# Altium schematic sheet mcu_stm32f427.SchDoc
size C; SheetNumber: 2
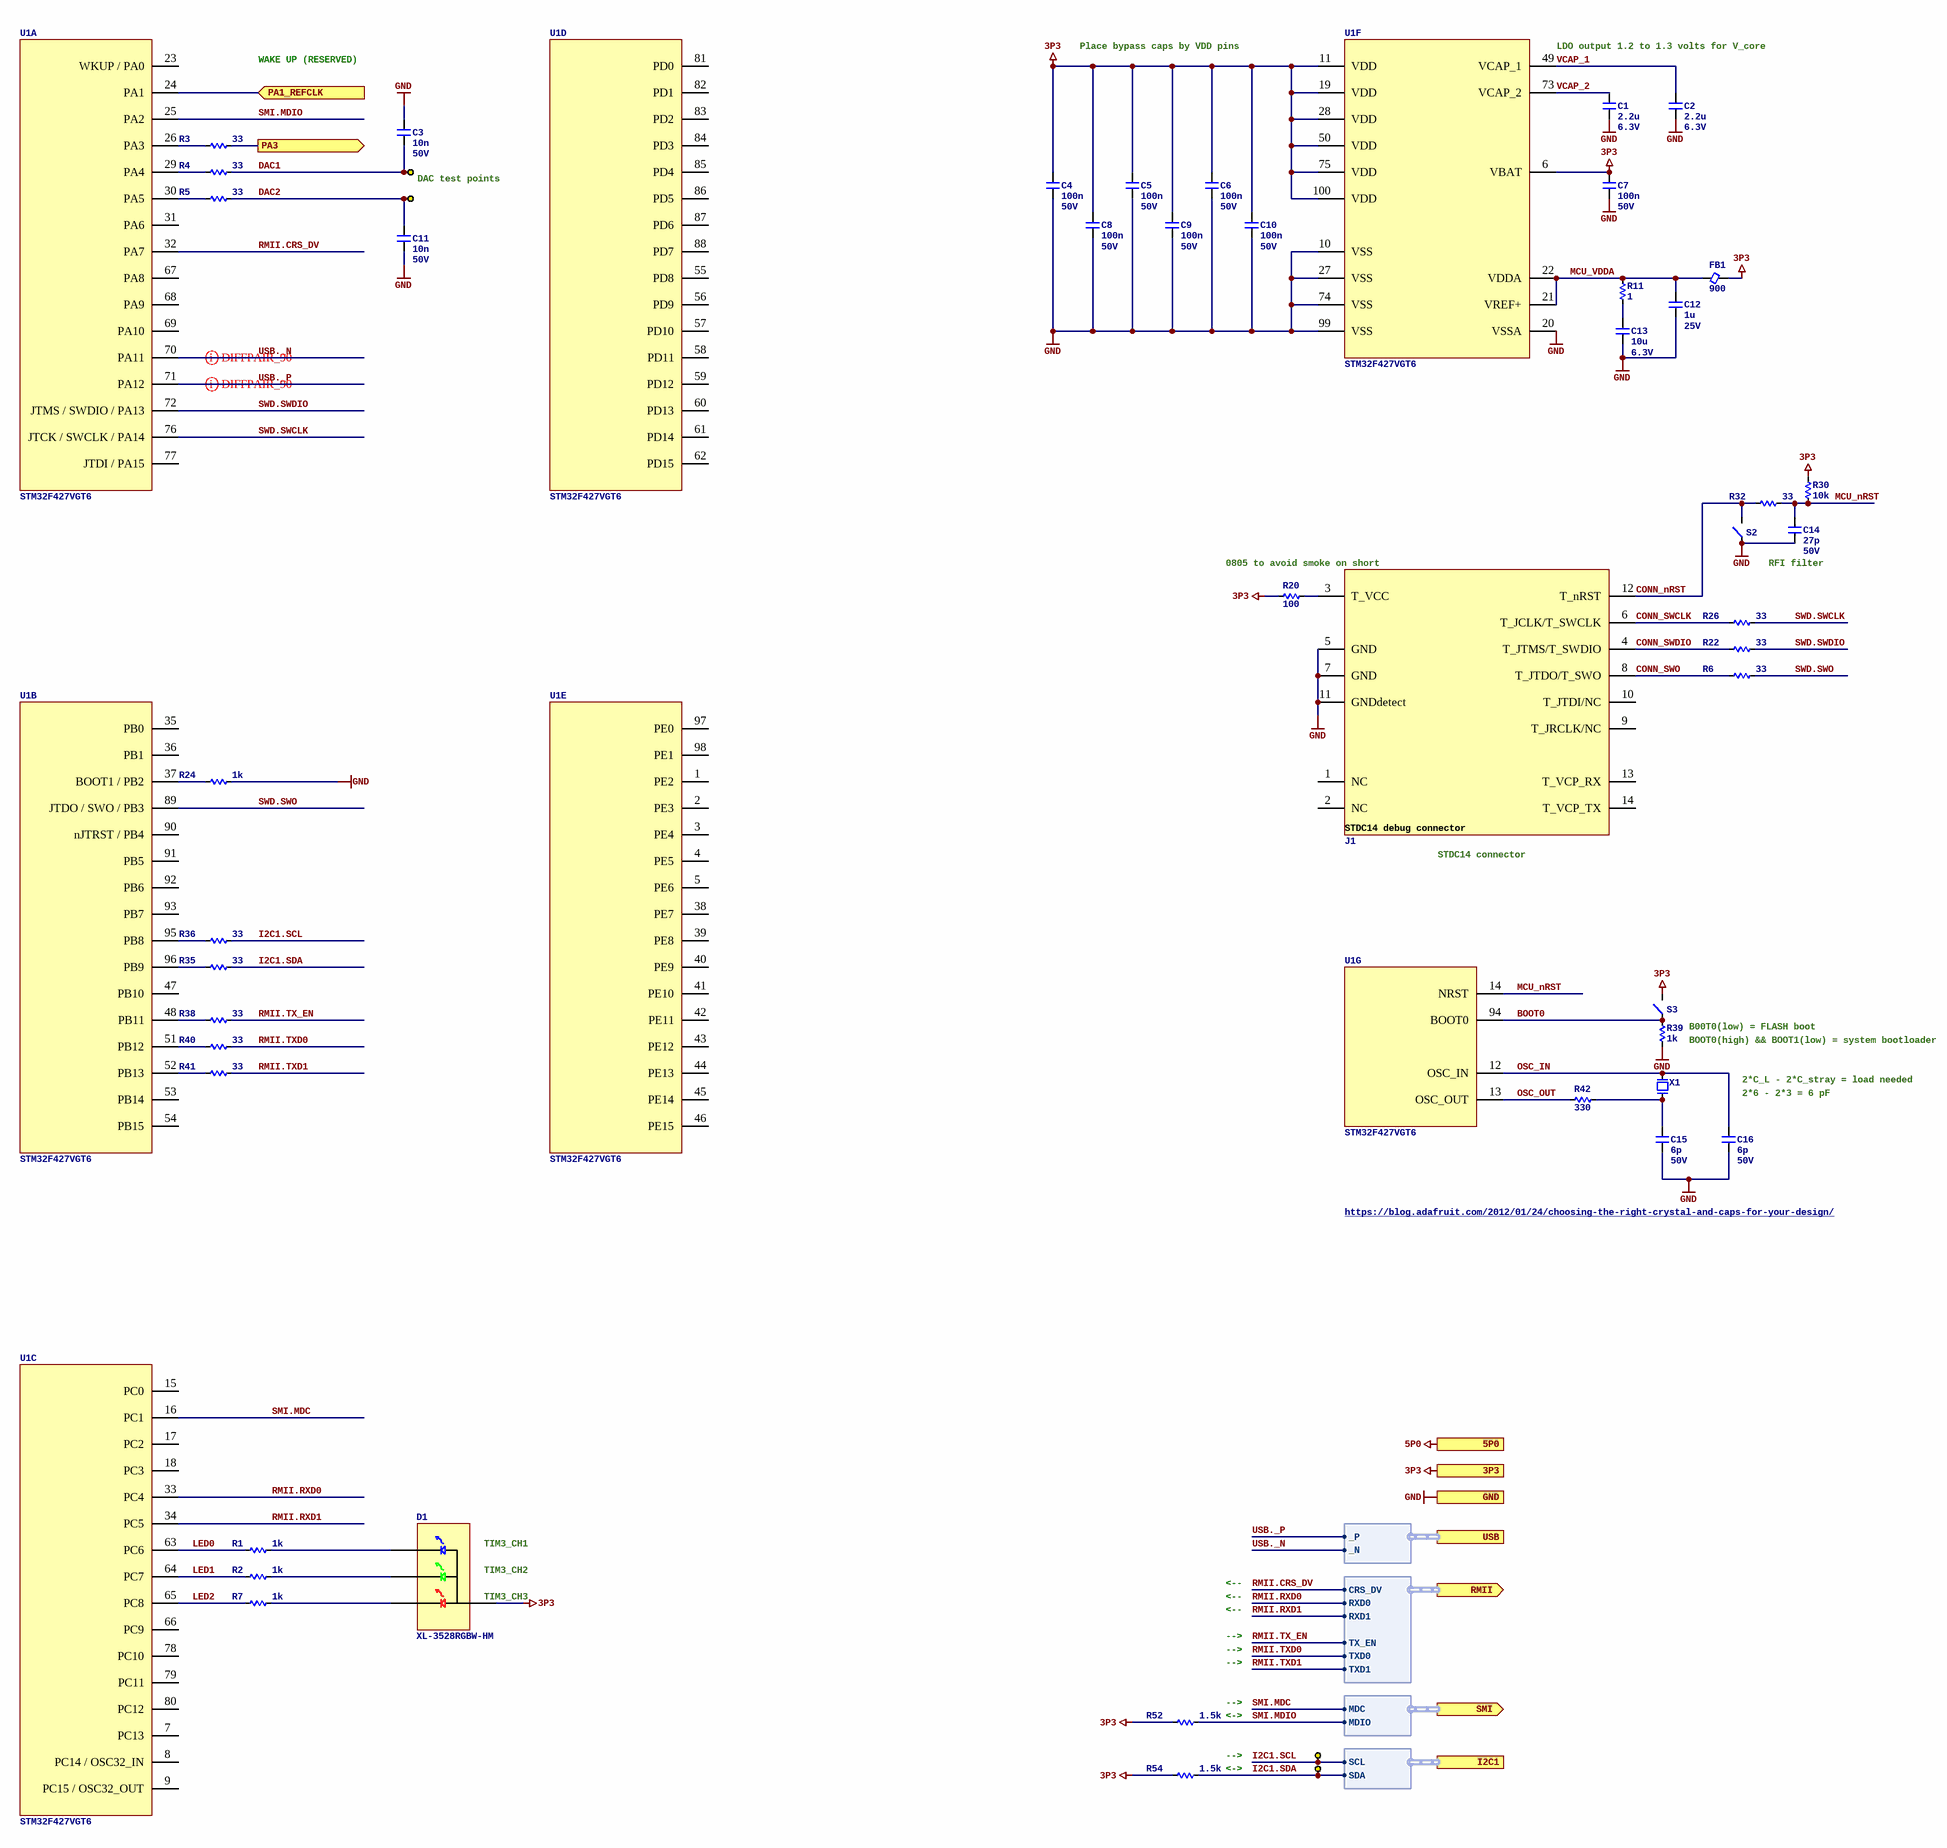
[diagram p0: mcu_stm32f427.SchDoc]

## Parts
C1  Capacitance: 2.2u  Voltage Rating: 6.3V  [C0603]  (hidden comment: GCM188R70J225KE22D)
C2  Capacitance: 2.2u  Voltage Rating: 6.3V  [C0603]  (hidden comment: GCM188R70J225KE22D)
C3  Capacitance: 10n  Voltage Rating: 50V  [C0402]  (hidden comment: CL05B103KB5NNNC)
C4  Capacitance: 100n  Voltage Rating: 50V  [C0402]  (hidden comment: CL05B104KB54PNC)
C5  Capacitance: 100n  Voltage Rating: 50V  [C0402]  (hidden comment: CL05B104KB54PNC)
C6  Capacitance: 100n  Voltage Rating: 50V  [C0402]  (hidden comment: CL05B104KB54PNC)
C7  Capacitance: 100n  Voltage Rating: 50V  [C0402]  (hidden comment: CL05B104KB54PNC)
C8  Capacitance: 100n  Voltage Rating: 50V  [C0402]  (hidden comment: CL05B104KB54PNC)
C9  Capacitance: 100n  Voltage Rating: 50V  [C0402]  (hidden comment: CL05B104KB54PNC)
C10  Capacitance: 100n  Voltage Rating: 50V  [C0402]  (hidden comment: CL05B104KB54PNC)
C11  Capacitance: 10n  Voltage Rating: 50V  [C0402]  (hidden comment: CL05B103KB5NNNC)
C12  Capacitance: 1u  Voltage Rating: 25V  [C0603]  (hidden comment: CL10B105KA8NNNC)
C13  Capacitance: 10u  Voltage Rating: 6.3V  [C0805]  (hidden comment: CC0805KKX7R5BB106)
C14  Capacitance: 27p  Voltage Rating: 50V  [C0402]  (hidden comment: CC0402JRNPO9BN270)
C15  Capacitance: 6p  Voltage Rating: 50V  [C0402]  (hidden comment: CC0402CRNPO9BN6R0)
C16  Capacitance: 6p  Voltage Rating: 50V  [C0402]  (hidden comment: CC0402CRNPO9BN6R0)
D1  XL-3528RGBW-HM  [LED_RGB_SMD3528-4P]
FB1  Current Rating (mA): 900  [FB0402]  (hidden comment: BLM15PX601SN1D)
J1  FTSH-107-01-L-DV-K-A  [SAMTEC_FTSH-107-01-L-DV-K-A]  (value not drawn)
R1  value 1k  [R0402]  (hidden comment: 0402WGF1001TCE)
R2  value 1k  [R0402]  (hidden comment: 0402WGF1001TCE)
R3  value 33  [R0402]  (hidden comment: CRCW040233R0FKED)
R4  value 33  [R0402]  (hidden comment: CRCW040233R0FKED)
R5  value 33  [R0402]  (hidden comment: CRCW040233R0FKED)
R6  value 33  [R0402]  (hidden comment: CRCW040233R0FKED)
R7  value 1k  [R0402]  (hidden comment: 0402WGF1001TCE)
R11  value 1  [R0402]  (hidden comment: CRCW04021R00FKEDC)
R20  value 100  [R0805]  (hidden comment: AR05FTC1000)
R22  value 33  [R0402]  (hidden comment: CRCW040233R0FKED)
R24  value 1k  [R0402]  (hidden comment: 0402WGF1001TCE)
R26  value 33  [R0402]  (hidden comment: CRCW040233R0FKED)
R30  value 10k  [R0402]  (hidden comment: 0402WGF1002TCE)
R32  value 33  [R0402]  (hidden comment: CRCW040233R0FKED)
R35  value 33  [R0402]  (hidden comment: CRCW040233R0FKED)
R36  value 33  [R0402]  (hidden comment: CRCW040233R0FKED)
R38  value 33  [R0402]  (hidden comment: CRCW040233R0FKED)
R39  value 1k  [R0402]  (hidden comment: 0402WGF1001TCE)
R40  value 33  [R0402]  (hidden comment: CRCW040233R0FKED)
R41  value 33  [R0402]  (hidden comment: CRCW040233R0FKED)
R42  value 330  [R0402]  (hidden comment: 0402WGF3300TCE)
R52  value 1.5k  [R0402]  (hidden comment: 0402WGF1501TCE)
R54  value 1.5k  [R0402]  (hidden comment: 0402WGF1501TCE)
S2  TS-1092S-B3D2-G  [SWITCH_TS-1092S-B3D2-G]  (value not drawn)
S3  TS-1092S-B3D2-G  [SWITCH_TS-1092S-B3D2-G]  (value not drawn)
TP1  (no value)  [TP_RH-5002]
TP2  (no value)  [TP_RH-5002]
TP62  (no value)  [TP_GRABBY]  (no BOM)
TP63  (no value)  [TP_GRABBY]  (no BOM)
U1  STM32F427VGT6  [100TQFP14]  (parts A,B,C,D,E,F,G of 7)
X1  XTAL_XRCGB25M000F3A00R0  [4_SMD_2.0X1.6MM]  (value not drawn)

## Ports
3P3, 5P0, GND, I2C1 (harness I2C), PA1_REFCLK (in), PA3 (out), RMII (out, harness RMII), SMI (out, harness SMI), USB (harness DIFF)

## Harnesses
RMII: CRS_DV, RXD0, RXD1, TX_EN, TXD0, TXD1
SMI: MDC, MDIO
DIFF: _P, _N
I2C: SCL, SDA

## Nets
3P3: C4.1 C5.1 C6.1 C7.1 C8.1 C9.1 C10.1 D1.2 FB1.2 R20.2 R30.1 R52.2 R54.2 S3.2 U1.6(VBAT) U1.11(VDD) U1.19(VDD) U1.28(VDD) U1.50(VDD) U1.75(VDD) U1.100(VDD) ; port 3P3
5P0: port 5P0
GND: C1.2 C2.2 C3.2 C4.2 C5.2 C6.2 C7.2 C8.2 C9.2 C10.2 C11.2 C12.2 C13.2 C14.2 C15.2 C16.2 J1.5(GND) J1.7(GND) J1.11(GNDdetect) R24.1 R39.2 S2.1 U1.10(VSS) U1.20(VSSA) U1.27(VSS) U1.74(VSS) U1.99(VSS) ; port GND
BOOT0: R39.1 S3.1 U1.94(BOOT0)
CONN_nRST: J1.12(T_nRST) R32.2 S2.2
CONN_SWCLK: J1.6(T_JCLK/T_SWCLK) R26.2
CONN_SWDIO: J1.4(T_JTMS/T_SWDIO) R22.2
CONN_SWO: J1.8(T_JTDO/T_SWO) R6.2
DAC1: C3.1 R4.1 TP1.1
DAC2: C11.1 R5.1 TP2.1
I2C1.SCL: R36.1 TP62.1 ; port I2C1.SCL
I2C1.SDA: R35.1 R54.1 TP63.1 ; port I2C1.SDA
LED0: R1.2 U1.63(PC6)
LED1: R2.2 U1.64(PC7)
LED2: R7.2 U1.65(PC8)
MCU_nRST: C14.1 R30.2 R32.1 U1.14(NRST)
MCU_VDDA: C12.1 FB1.1 R11.2 U1.21(VREF+) U1.22(VDDA)
OSC_IN: C16.1 U1.12(OSC_IN) X1.3
OSC_OUT: R42.1 U1.13(OSC_OUT)
PA1_REFCLK: U1.24(PA1) ; port PA1_REFCLK
PA3: R3.1 ; port PA3
RMII.CRS_DV: U1.32(PA7) ; port RMII.CRS_DV
RMII.RXD0: U1.33(PC4) ; port RMII.RXD0
RMII.RXD1: U1.34(PC5) ; port RMII.RXD1
RMII.TX_EN: R38.1 ; port RMII.TX_EN
RMII.TXD0: R40.1 ; port RMII.TXD0
RMII.TXD1: R41.1 ; port RMII.TXD1
SMI.MDC: U1.16(PC1) ; port SMI.MDC
SMI.MDIO: R52.1 U1.25(PA2) ; port SMI.MDIO
SWD.SWCLK: R26.1 U1.76(JTCK_/_SWCLK_/_PA14)
SWD.SWDIO: R22.1 U1.72(JTMS_/_SWDIO_/_PA13)
SWD.SWO: R6.1 U1.89(JTDO_/_SWO_/_PB3)
USB._N: U1.70(PA11) ; port USB._N
USB._P: U1.71(PA12) ; port USB._P
VCAP_1: C2.1 U1.49(VCAP_1)
VCAP_2: C1.1 U1.73(VCAP_2)
NetC13_1: C13.1 R11.1
NetC15_1: C15.1 R42.2 X1.1
NetD1_1: D1.1 R7.1
NetD1_3: D1.3 R2.1
NetD1_4: D1.4 R1.1
NetJ1_3: J1.3(T_VCC) R20.1
NetR3_2: R3.2 U1.26(PA3)
NetR4_2: R4.2 U1.29(PA4)
NetR5_2: R5.2 U1.30(PA5)
NetR24_2: R24.2 U1.37(BOOT1_/_PB2)
NetR35_2: R35.2 U1.96(PB9)
NetR36_2: R36.2 U1.95(PB8)
NetR38_2: R38.2 U1.48(PB11)
NetR40_2: R40.2 U1.51(PB12)
NetR41_2: R41.2 U1.52(PB13)

Not connected (* = marked no-connect by the designer): J1 1(NC) 2(NC) 9(T_JRCLK/NC) 10(T_JTDI/NC) 13(T_VCP_RX) 14(T_VCP_TX); U1 1(PE2) 2(PE3) 3(PE4) 4(PE5) 5(PE6) 7(PC13) 8(PC14_/_OSC32_IN) 9(PC15_/_OSC32_OUT) 15(PC0) 17(PC2) 18(PC3) 23(WKUP_/_PA0) 31(PA6) 35(PB0) 36(PB1) 38(PE7) 39(PE8) 40(PE9) 41(PE10) 42(PE11) 43(PE12) 44(PE13) 45(PE14) 46(PE15) 47(PB10) 53(PB14) 54(PB15) 55(PD8) 56(PD9) 57(PD10) 58(PD11) 59(PD12) 60(PD13) 61(PD14) 62(PD15) 66(PC9) 67(PA8) 68(PA9) 69(PA10) 77(JTDI_/_PA15) 78(PC10) 79(PC11) 80(PC12) 81(PD0) 82(PD1) 83(PD2) 84(PD3) 85(PD4) 86(PD5) 87(PD6) 88(PD7) 90(nJTRST_/_PB4) 91(PB5) 92(PB6) 93(PB7) 97(PE0) 98(PE1)

## Layout directives
differential pair; differential pair class DE_90: USB._N, USB._P

## Notes on the sheet
- WAKE UP (RESERVED)
- Place bypass caps by VDD pins
- (near U1) LDO output 1.2 to 1.3 volts for V_core
- (near TP1) DAC test points
- 0805 to avoid smoke on short
- RFI filter
- (near J1) STDC14 connector
- B00T0(low) = FLASH boot
- BOOT0(high) && BOOT1(low) = system bootloader
- 2*C_L - 2*C_stray = load needed
- (near C16) 2*6 - 2*3 = 6 pF
- https://blog.adafruit.com/2012/01/24/choosing-the-right-crystal-and-caps-for-your-design/
- (near D1) TIM3_CH1
- (near D1) TIM3_CH2
- <--
- (near D1) TIM3_CH3
- -->
- (near R52) <->
- (near R52) -->
- (near R54) <->
- (in symbol CONN_14POS_50MIL_ST_CORTEX_DEBUG_VCP) STDC14 debug connector

## Library data of the parts
C1 C2 = GCM188R70J225KE22D: Manufacturer: Murata Electronics; Dielectric: X7R; ComponentLink1URL: https://wmsc.lcsc.com/wmsc/upload/file/pdf/v2/lcsc/1810311130_Murata-Electronics-GCM188R70J225KE22D_C126582.pdf; ComponentLink1Description: Datasheet; Manufacturer Part Number: GCM188R70J225KE22D; Package: 0603; Supplier 2: LCSC; Supplier Part Number 2: C126582
C3 C11 = CL05B103KB5NNNC: Manufacturer: Samsung Electro-Mechanics; Dielectric: X7R; ComponentLink1URL: https://wmsc.lcsc.com/wmsc/upload/file/pdf/v2/lcsc/2304140030_Samsung-Electro-Mechanics-CL05B103KB5NNNC_C15195.pdf; ComponentLink1Description: Datasheet; Manufacturer Part Number: CL05B103KB5NNNC; Package: 0402; Supplier 2: LCSC; Supplier Part Number 2: C15195
C4-C10 = CL05B104KB54PNC: Manufacturer: Samsung Electro-Mechanics; Dielectric: X7R; ComponentLink1URL: https://wmsc.lcsc.com/wmsc/upload/file/pdf/v2/lcsc/2304140030_Samsung-Electro-Mechanics-CL05B104KB54PNC_C307331.pdf; ComponentLink1Description: Datasheet; Manufacturer Part Number: CL05B104KB54PNC; Package: 0402; Supplier 2: LCSC; Supplier Part Number 2: C307331
C12 = CL10B105KA8NNNC: Manufacturer: Samsung Electro-Mechanics; Dielectric: X7R; ComponentLink1URL: https://wmsc.lcsc.com/wmsc/upload/file/pdf/v2/lcsc/2304140030_Samsung-Electro-Mechanics-CL10B105KA8NNNC_C29936.pdf; ComponentLink1Description: Datasheet; Manufacturer Part Number: CL10B105KA8NNNC; Package: 0603; Supplier 2: LCSC; Supplier Part Number 2: C29936
C13 = CC0805KKX7R5BB106: Manufacturer: YAGEO; Dielectric: X7R; ComponentLink1URL: https://wmsc.lcsc.com/wmsc/upload/file/pdf/v2/lcsc/2409272300_YAGEO-CC0805KKX7R5BB106_C527225.pdf; ComponentLink1Description: Datasheet; Manufacturer Part Number: CC0805KKX7R5BB106; Package: 0805; Supplier 2: LCSC; Supplier Part Number 2: C527225
C14 = CC0402JRNPO9BN270: Manufacturer: YAGEO; Dielectric: NP0; ComponentLink1URL: https://wmsc.lcsc.com/wmsc/upload/file/pdf/v2/lcsc/2304140030_YAGEO-CC0402JRNPO9BN270_C107002.pdf; ComponentLink1Description: Datasheet; Manufacturer Part Number: CC0402JRNPO9BN270; Package: 0402; Supplier 2: LCSC; Supplier Part Number 2: C107002
C15 C16 = CC0402CRNPO9BN6R0: Manufacturer: YAGEO; Dielectric: NP0; ComponentLink1URL: https://wmsc.lcsc.com/wmsc/upload/file/pdf/v2/lcsc/2007101237_YAGEO-CC0402CRNPO9BN6R0_C700515.pdf; ComponentLink1Description: Datasheet; Manufacturer Part Number: CC0402CRNPO9BN6R0; Package: 0402; Supplier 2: LCSC; Supplier Part Number 2: C700515
D1 = LED_RGB_XL-3528RGBW-HM: LED Multi-Color Chip Red/Green/Blue 621nm/525nm/468nm 25mA/15mA/15mA 4-Pin PLCC T/R; Manufacturer: XINGLIGHT; Supplier 1: Digikey; Supplier Part Number 1: 5962-XL-3528RGBW-HMTR-ND; Manufacturer Part Number: XL-3528RGBW-HM; ComponentLink1Description: Datasheet; ComponentLink1URL: https://mm.digikey.com/Volume0/opasdata/d220001/medias/docus/8903/XL-3528RGBW-HM.pdf; Supplier 2: LCSC; Supplier Part Number 2: C2843813
FB1 = BLM15PX601SN1D: Manufacturer: Murata Electronics; Z @ 100 MHz: 600; DCR (mOhms): 230; ComponentLink1URL: https://wmsc.lcsc.com/wmsc/upload/file/pdf/v2/lcsc/2304140030_Murata-Electronics-BLM15PX601SN1D_C160977.pdf; ComponentLink1Description: Datasheet; Manufacturer Part Number: BLM15PX601SN1D; Supplier 2: LCSC; Supplier Part Number 2: C160977; Package: 0402
J1 = CONN_14POS_50MIL_ST_CORTEX_DEBUG_VCP: Connector Header Surface Mount 14 position 0.050" (1.27mm); Manufacturer: Samtec; Supplier 1: Digikey; Supplier Part Number 1: FTSH-107-01-L-DV-K-A-ND; Manufacturer Part Number: FTSH-107-01-L-DV-K-A; Supplier 2: LCSC; Supplier Part Number 2: C5563894; ComponentLink2URL: https://mm.digikey.com/Volume0/opasdata/d220001/medias/docus/6209/ftsh-1xx-xx-xxx-dv-xxx-xxx-x-xx-mkt.pdf; ComponentLink2Description: Datasheet
R1 R2 R7 R24 R39 = 0402WGF1001TCE: Manufacturer: UNI-ROYAL(Uniroyal Elec); Tolerance: 1%; Temperature Coefficient: Â±100ppm/â„ƒ; Power Rating (mW): 62.5; ComponentLink1Description: Datasheet; ComponentLink1URL: https://wmsc.lcsc.com/wmsc/upload/file/pdf/v2/lcsc/2206010216_UNI-ROYAL-Uniroyal-Elec-0402WGF1001TCE_C11702.pdf; Manufacturer Part Number: 0402WGF1001TCE; Package: 0402; Supplier 2: LCSC; Supplier Part Number 2: C11702
R3-R6 R22 R26 R32 R35 R36 R38 R40 R41 = CRCW040233R0FKED: Manufacturer: Vishay Intertech; Tolerance: 1%; Temperature Coefficient: Â±100ppm/â„ƒ; Power Rating (mW): 63; ComponentLink1Description: Datasheet; ComponentLink1URL: https://wmsc.lcsc.com/wmsc/upload/file/pdf/v2/lcsc/2304140030_Vishay-Intertech-CRCW040233R0FKED_C242490.pdf; Manufacturer Part Number: CRCW040233R0FKED; Package: 0402; Supplier 2: LCSC; Supplier Part Number 2: C242490
R11 = CRCW04021R00FKEDC: Manufacturer: Vishay Intertech; Tolerance: 1%; Temperature Coefficient: Â±100ppm/â„ƒ; Power Rating (mW): 62.5; ComponentLink1Description: Datasheet; ComponentLink1URL: https://datasheet.lcsc.com/lcsc/2304140030_Vishay-Intertech-CRCW04021R00FKEDC_C2077765.pdf; Manufacturer Part Number: CRCW04021R00FKEDC; Package: 0402; Supplier 2: LCSC; Supplier Part Number 2: C2077765
R20 = AR05FTC1000: Manufacturer: Viking Tech; Tolerance: 1%; Temperature Coefficient: Â±25ppm/â„ƒ; ComponentLink1Description: Datasheet; ComponentLink1URL: https://wmsc.lcsc.com/wmsc/upload/file/pdf/v2/lcsc/2409280202_Viking-Tech-AR05FTC1000_C234699.pdf; Manufacturer Part Number: AR05FTC1000; Package: 0805; Power Rating (mW): 100; Supplier 2: LCSC; Supplier Part Number 2: C234699
R30 = 0402WGF1002TCE: Manufacturer: UNI-ROYAL(Uniroyal Elec); Tolerance: 1%; Temperature Coefficient: Â±100ppm/â„ƒ; Power Rating (mW): 62.5; ComponentLink1Description: Datasheet; ComponentLink1URL: https://wmsc.lcsc.com/wmsc/upload/file/pdf/v2/lcsc/2206010100_UNI-ROYAL-Uniroyal-Elec-0402WGF1002TCE_C25744.pdf; Manufacturer Part Number: 0402WGF1002TCE; Package: 0402; Supplier 2: LCSC; Supplier Part Number 2: C25744
R42 = 0402WGF3300TCE: Manufacturer: UNI-ROYAL(Uniroyal Elec); Tolerance: 1%; Temperature Coefficient: Â±100ppm/â„ƒ; Power Rating (mW): 62.5; ComponentLink1Description: Datasheet; ComponentLink1URL: https://wmsc.lcsc.com/wmsc/upload/file/pdf/v2/lcsc/2205311900_UNI-ROYAL-Uniroyal-Elec-0402WGF3300TCE_C25104.pdf; Manufacturer Part Number: 0402WGF3300TCE; Package: 0402; Supplier 2: LCSC; Supplier Part Number 2: C25104
R52 R54 = 0402WGF1501TCE: Manufacturer: UNI-ROYAL(Uniroyal Elec); Tolerance: 1%; Temperature Coefficient: Â±100ppm/â„ƒ; Power Rating (mW): 62.5; ComponentLink1Description: Datasheet; ComponentLink1URL: https://wmsc.lcsc.com/wmsc/upload/file/pdf/v2/lcsc/2206010045_UNI-ROYAL-Uniroyal-Elec-0402WGF1501TCE_C25867.pdf; Manufacturer Part Number: 0402WGF1501TCE; Package: 0402; Supplier 2: LCSC; Supplier Part Number 2: C25867
S2 S3 = SWITCH_TS-1092S-B3D2-G: SWITCH TACTILE SPST-NO; Manufacturer: Yuandi; Supplier 1: LCSC; Supplier Part Number 1: C520860; Manufacturer Part Number: TS-1092S-B3D2-G; ComponentLink1Description: Datasheet; ComponentLink1URL: https://www.lcsc.com/datasheet/lcsc_datasheet_2005071437_Yuandi-TS-1092S-B3D2-G_C520860.pdf
TP1 TP2 = RH-5002: THT white clip turret; Manufacturer: ronghe; ComponentLink1Description: Datasheet; ComponentLink1URL: https://datasheet.lcsc.com/lcsc/2307040929_ronghe-RH-5000_C5277086.pdf; Supplier 1: LCSC; Supplier Part Number 1: C5199802; Manufacturer Part Number: RH-5002
TP62 TP63 = TEST_GRABBER: EMBEDDED TEST POINT FOR SALEAE TEST CLIPS
U1 = MCU_STM32F427VGT6: ARM Cortex®-M4 STM32F4 Microcontroller IC 32-Bit 180MHz 1MB (1M x 8) FLASH 100-LQFP (14x14); Manufacturer: ST Microelectronics; Manufacturer Part Number: STM32F427VGT6; Supplier 1: Digikey; Supplier Part Number 1: 497-17449-ND; Supplier 2: LCSC; Supplier Part Number 2: C117815; ComponentLink1Description: Datasheet; ComponentLink1URL: https://www.st.com/content/ccc/resource/technical/document/datasheet/03/b4/b2/36/4c/72/49/29/DM00071990.pdf/files/DM00071990.pdf/jcr:content/translations/en.DM00071990.pdf; ComponentLink2Description: Reference Manual; ComponentLink2URL: https://www.st.com/resource/en/reference_manual/rm0090-stm32f405415-stm32f407417-stm32f427437-and-stm32f429439-advanced-armbased-32bit-mcus-stmicroelectronics.pdf; ComponentLink3Description: AN1709: Bootloader; ComponentLink3URL: https://www.st.com/resource/en/application_note/an2606-stm32-microcontroller-system-memory-boot-mode-stmicroelectronics.pdf
X1 = XTAL_XRCGB25M000F3A00R0: CRYSTAL 25.000MHZ 6PF SMD; Manufacturer: Murata; Supplier 1: Digikey; Supplier Part Number 1: 490-12146-2-ND; Manufacturer Part Number: XRCGB25M000F3A00R0; Supplier 2: LCSC; Supplier Part Number 2: C467842; ComponentLink1Description: Datasheet; ComponentLink1URL: https://www.murata.com/products/productdata/8801076543518/SPEC-XRCGB25M000F3A00R0.pdf